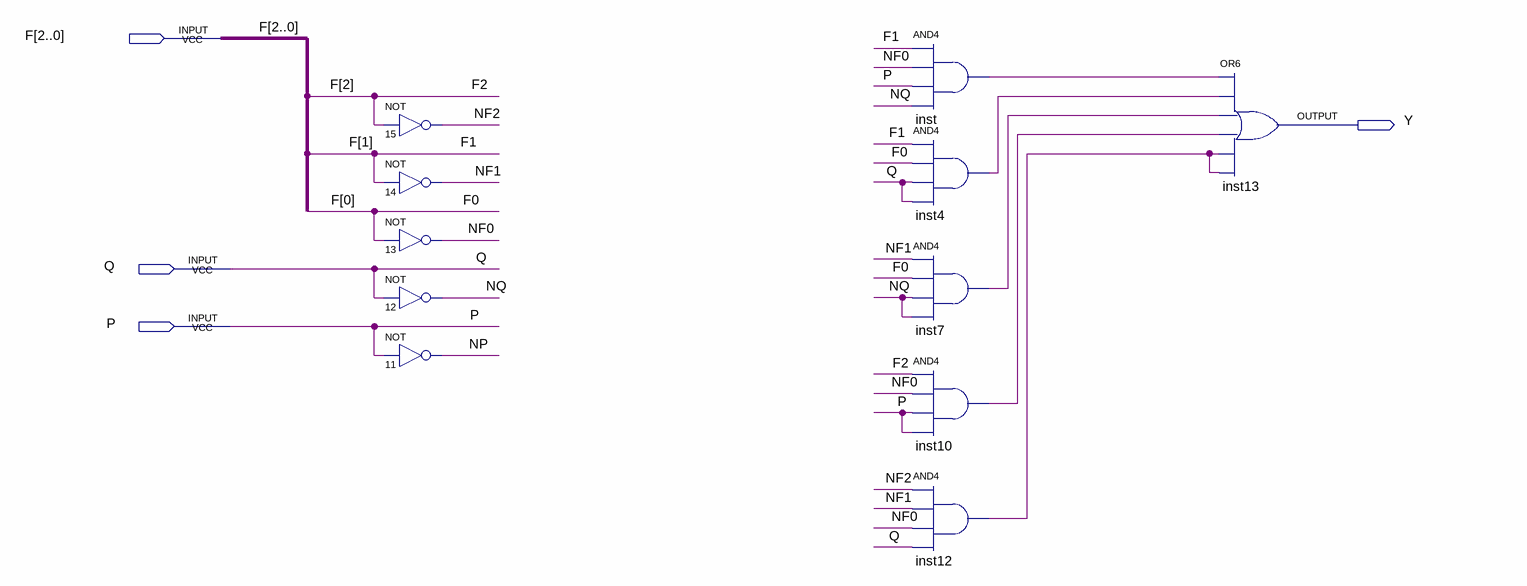
[diagram p0: schematic sheet]
// Quartus schematic y.bdf as structural Verilog: 11 symbols, 4 pins
module y (
  input  [2:0] F,
  input  Q,
  input  P,
  output Y
);

  wire inst4_out, inst7_out, inst10_out, inst12_out, inst_out, NF0, NF1, NF2, NP, NQ;

  not u_15 (NF2, F[2]);
  not u_14 (NF1, F[1]);
  not u_13 (NF0, F[0]);
  not u_12 (NQ, Q);
  not u_11 (NP, P);
  and inst (inst_out, F[1], NF0, P, NQ);
  and inst4 (inst4_out, F[1], F[0], Q, Q);
  and inst7 (inst7_out, NF1, F[0], NQ, NQ);
  and inst10 (inst10_out, F[2], NF0, P, P);
  and inst12 (inst12_out, NF2, NF1, NF0, Q);
  or inst13 (Y, inst_out, inst4_out, inst7_out, inst10_out, inst12_out, inst12_out);
endmodule
